# Altium schematic sheet LPCB220 - AUXPROP INTERFACE.SchDoc
size A3; Address1: Factory 10; Address2: 9-13 Dingley Avenue, Dandeong, VICTORIA 3175, AUSTRALIA; DocumentNumber: 2; Revision: 1; SheetNumber: 2; SheetTotal: 18; Lockie__PCB_SUB_ASSEMBLY: Aux Prop Interface; Lockie__PCB_ASSEMBLY: Brake Control; Lockie__LDL: LPCB220; Lockie__PCB_DESCRIPTION: Redundant Stepper Node
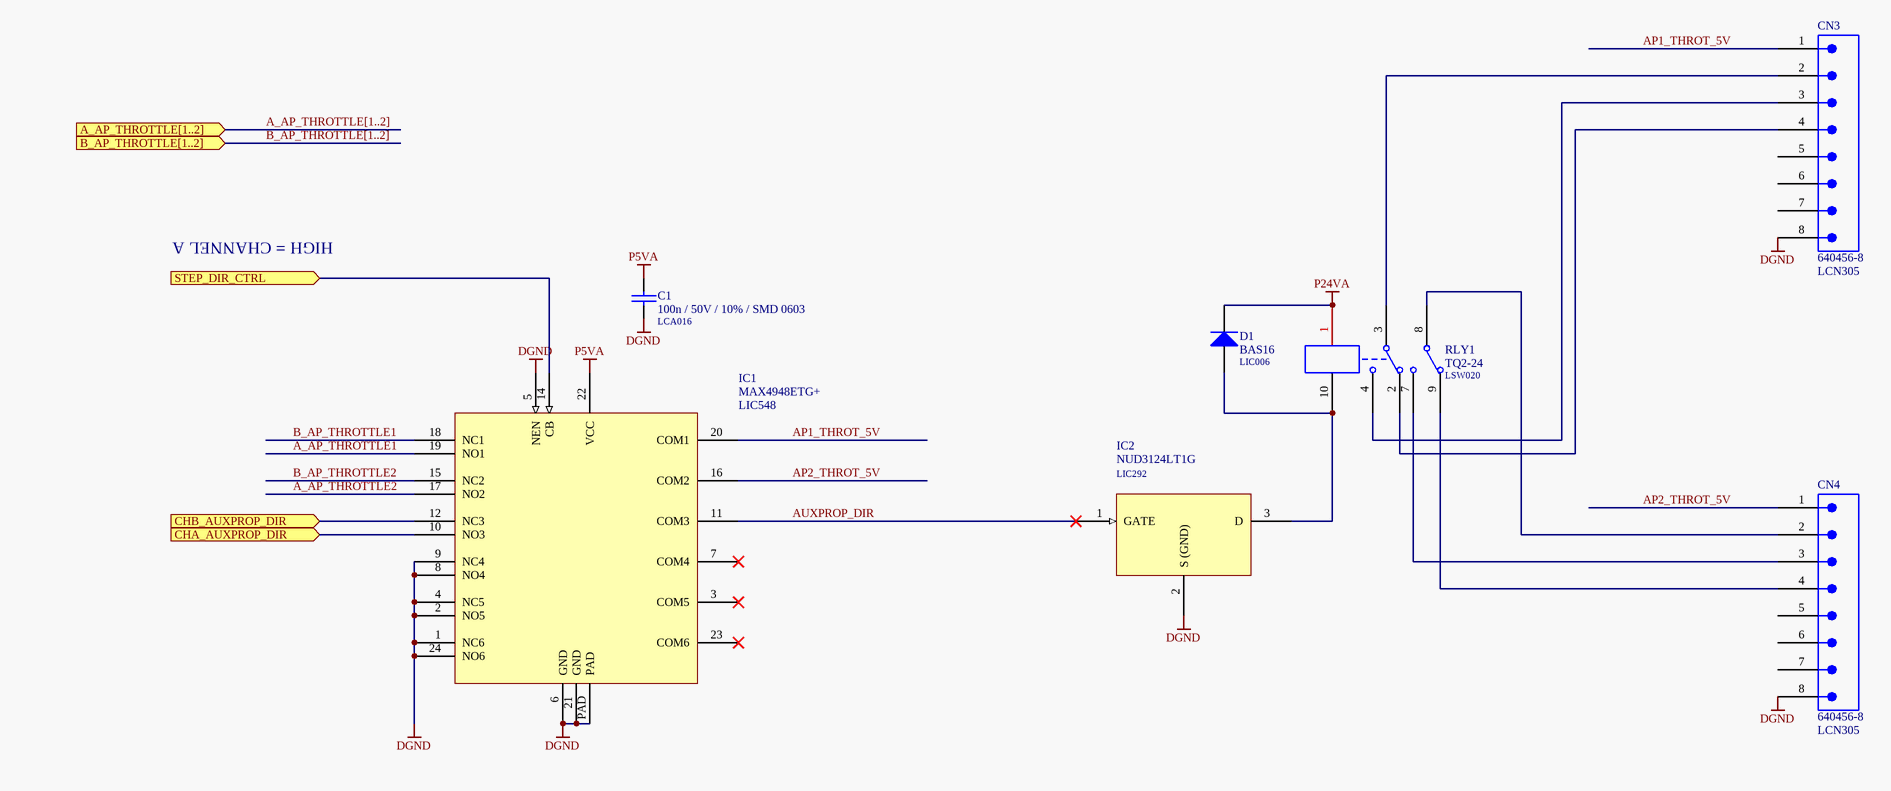
[diagram p0: LPCB220 - AUXPROP INTERFACE.SchDoc]

## Parts
C1  100n / 50V / 10% / SMD 0603  LDL_NUMBER: LCA016  [LFP011__CC1608-0603-IPC7351_B]
CN3  640456-8  LDL_NUMBER: LCN305  [640456-8]
CN4  640456-8  LDL_NUMBER: LCN305  [640456-8]
D1  BAS16  LDL_NUMBER: LIC006  [LFP021__SOT23]
IC1  MAX4948ETG+  LDL_NUMBER: LIC548  [LFP095__QFN127P600-8N]
IC2  NUD3124LT1G  LDL_NUMBER: LIC292  [LFP021__SOT23]
RLY1  TQ2-24  LDL_NUMBER: LSW020  [TQ2]

## Ports
A_AP_THROTTLE[1..2] (in), B_AP_THROTTLE[1..2] (in), CHA_AUXPROP_DIR (in), CHB_AUXPROP_DIR (in), STEP_DIR_CTRL (in)

## Nets
DGND: C1.2 CN3.8 CN4.8 IC1.1(NC6) IC1.2(NO5) IC1.4(NC5) IC1.5(NEN) IC1.6(GND) IC1.8(NO4) IC1.9(NC4) IC1.21(GND) IC1.24(NO6) IC1.PAD IC2.2(S_(GND))
P5VA: C1.1 IC1.22(VCC)
P24VA: D1.3(K) RLY1.1
A_AP_THROTTLE1: IC1.19(NO1)
A_AP_THROTTLE2: IC1.17(NO2)
AP1_THROT_5V: CN3.1 IC1.20(COM1)
AP2_THROT_5V: CN4.1 IC1.16(COM2)
AUXPROP_DIR: IC1.11(COM3) IC2.1(GATE)
B_AP_THROTTLE1: IC1.18(NC1)
B_AP_THROTTLE2: IC1.15(NC2)
CHA_AUXPROP_DIR: IC1.10(NO3) ; port CHA_AUXPROP_DIR
CHB_AUXPROP_DIR: IC1.12(NC3) ; port CHB_AUXPROP_DIR
STEP_DIR_CTRL: IC1.14(CB) ; port STEP_DIR_CTRL
NetCN3_2: CN3.2 RLY1.3
NetCN3_3: CN3.3 RLY1.4
NetCN3_4: CN3.4 RLY1.2
NetCN4_2: CN4.2 RLY1.8
NetCN4_3: CN4.3 RLY1.7
NetCN4_4: CN4.4 RLY1.9
NetD1_1: D1.1(A) IC2.3(D) RLY1.10

Not connected (* = marked no-connect by the designer): CN3 5 6 7; CN4 5 6 7; IC1 3(COM5)* 7(COM4)* 23(COM6)*

## Buses and harness runs
bus A_AP_THROTTLE[1..2] = port A_AP_THROTTLE[1..2]
bus B_AP_THROTTLE[1..2] = port B_AP_THROTTLE[1..2]

## Notes on the sheet
- HIGH = CHANNEL A
- PCB COMPONENT DESCRIPTION
- LDL NUMBER
- Assembly Details
- Size
- Drawing File Name
- Revision
- http://rloop.org
- Scale
- A3
- Sheet Details
- N.T.S
- Sheet:
- Of:

## Library data of the parts
C1 = 100n / 50V / 10% / SMD 0603: Capacitor, Ceramic Chip, 100nF (0.1uF), 50V, 5%, SMD 0603 [LCA016]; FMEDA__OPERATING__VOLTAGE_MIN: 0; FMEDA__OPERATING__VOLTAGE_MAX: 3.3; FMEDA__OPERATING__TEMP_MIN: -20; FMEDA__OPERATING__TEMP_TYP: 27; FMEDA__OPERATING__TEMP_MAX: 50; FMEDA__CHANNEL: COM; Value: 100n; FMEDA__FUNCTION_IN_SYSTEM: *; FMEDA__OPERATING__VOLTAGE_TYP: 3.3
CN3 CN4 = 640456-8: Connector, Male Header, 8 Way; FMEDA__CHANNEL: COM; FMEDA__OPERATING__CURRENT_MAX: 0; FMEDA__OPERATING__TEMP_MAX: 50; FMEDA__OPERATING__TEMP_MIN: -20; FMEDA__OPERATING__TEMP_TYP: 27; FMEDA__OPERATING__VOLTAGE_MAX: 16; FMEDA__OPERATING__VOLTAGE_TYP: 12; FMEDA__FUNCTION_IN_SYSTEM: *; FMEDA__OPERATING__CURRENT_MIN: 0; FMEDA__OPERATING__CURRENT_TYP: 0; FMEDA__OPERATING__VOLTAGE_MIN: 0
D1 = BAS16: Diode, Small Signal, 0.2A, 85V, SMD SOT-23 [LIC006]; FMEDA__OPERATING__CURRENT_MIN: 0; FMEDA__OPERATING__TEMP_MIN: -20; FMEDA__OPERATING__TEMP_TYP: 27; FMEDA__OPERATING__TEMP_MAX: 50; FMEDA__CHANNEL: COM; FMEDA__OPERATING__CURRENT_MAX: 0; FMEDA__OPERATING__VOLTAGE_MIN: 0; FMEDA__OPERATING__VOLTAGE_MAX: 0; FMEDA__FUNCTION_IN_SYSTEM: *; FMEDA__OPERATING__CURRENT_TYP: 0; FMEDA__OPERATING__VOLTAGE_TYP: 0
IC1 = MAX4948ETG+: IC, Analog Switch, SMD [LIC548]
IC2 = NUD3124LT1G: IC, Relay Driver, 28V Industrial, SMD SOT23 [LIC292]; FMEDA__OPERATING__TEMP_MIN: -20; FMEDA__OPERATING__TEMP_TYP: 27; FMEDA__OPERATING__TEMP_MAX: 50; FMEDA__OPERATING__VOLTAGE_MIN: 0; FMEDA__OPERATING__VOLTAGE_TYP: 13; FMEDA__OPERATING__VOLTAGE_MAX: 18; FMEDA__OPERATING__POWER_TYP: 0.1; FMEDA__OPERATING__POWER_MAX: 0.15; FMEDA__CHANNEL: COM; FMEDA__FUNCTION_IN_SYSTEM: *; FMEDA__OPERATING__POWER_MIN: 0
RLY1 = TQ2-24: Relay, DPDT, Non Latching, 24VDC Coil, 1A Rating, PTH; FMEDA__CHANNEL: COM; FMEDA__OPERATING__TEMP_MAX: 50; FMEDA__OPERATING__TEMP_MIN: -20; FMEDA__OPERATING__TEMP_TYP: 27; Revision: July-2002: Re-released for DXP Platform.